# EAGLE design SSB Transceiver_LC Double Tuned Bandpass Filter (EAGLE 9.4.2)
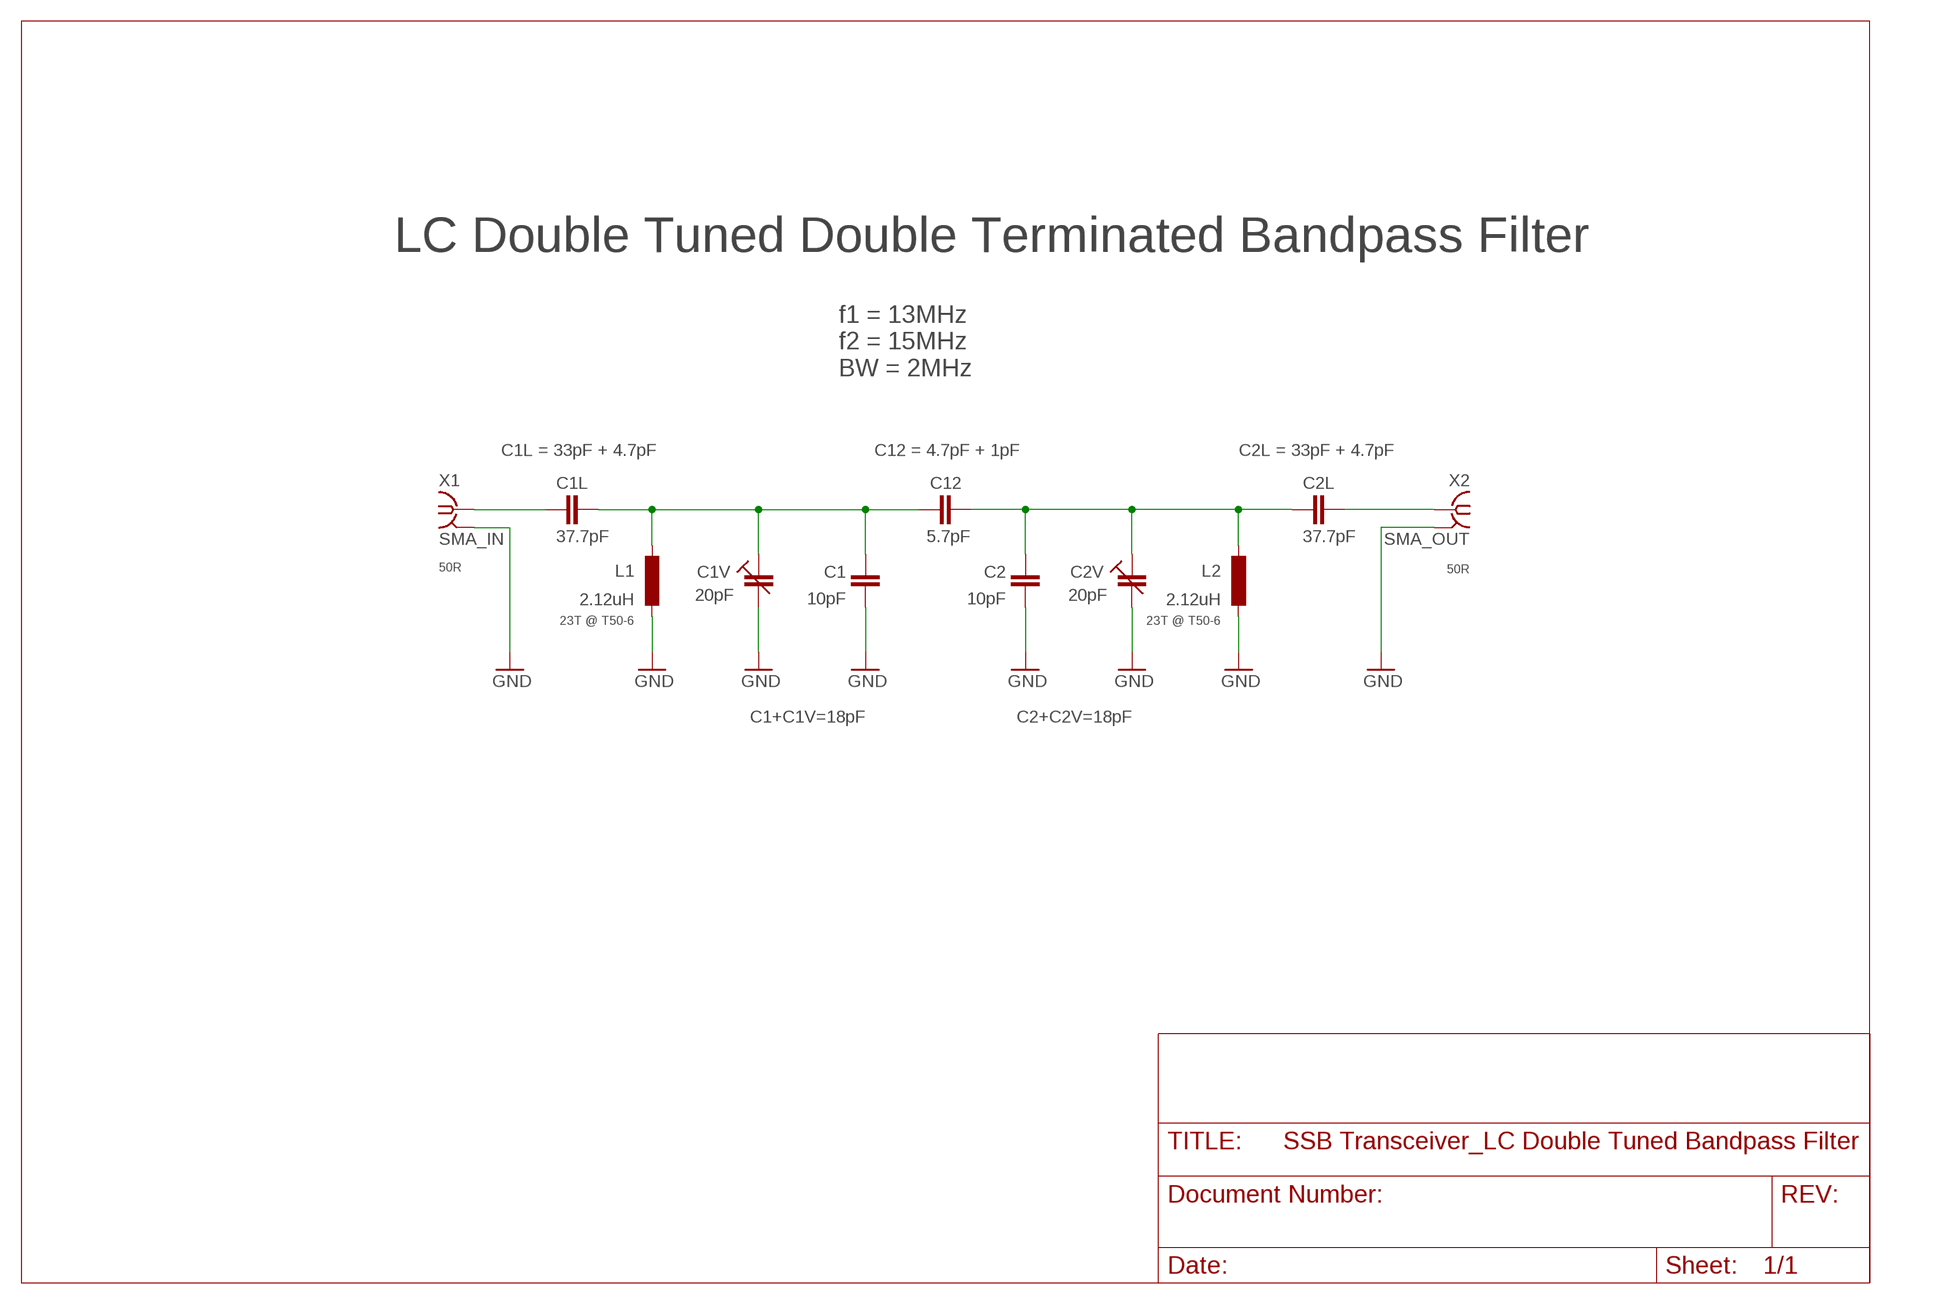
[diagram p0: schematic, sheet 1]

## Parts
C1  10pF  C-EUC0805  [C0805]
C1L  37.7pF  C-EUC0805  [C0805]
C1V  20pF  VARIABLECAP  [VARIABLECAP-SMD]
C2  10pF  C-EUC0805  [C0805]
C2L  37.7pF  C-EUC0805  [C0805]
C2V  20pF  VARIABLECAP  [VARIABLECAP-SMD]
C12  5.7pF  C-EUC0805  [C0805]
L1  2.12uH  T50-6  [T50-6SMD]
L2  2.12uH  T50-6  [T50-6SMD]
X1  SMA_IN  SMA-142-0711-821/826  [J502-ND-142-0711-821/826]
X2  SMA_OUT  SMA-142-0711-821/826  [J502-ND-142-0711-821/826]

## Nets
GND: C1.1 C1V.P$2(A) C2.1 C2V.P$2(A) L1.P$2 L2.P$2 X1.G@1 X1.G@2 X1.G@3 X1.G@4 X2.G@1 X2.G@2 X2.G@3 X2.G@4
N$1: C1.2 C1L.2 C1V.P$1(E) C12.1 L1.P$1
N$2: C2.2 C2L.2 C2V.P$1(E) C12.2 L2.P$1
N$3: C2L.1 X2.1
N$4: C1L.1 X1.1

## Notes on the sheet
- LC Double Tuned Double Terminated Bandpass Filter
- f1 = 13MHz
  f2 = 15MHz
  BW = 2MHz
- C1L = 33pF + 4.7pF | C12 = 4.7pF + 1pF | C2L = 33pF + 4.7pF
- 50R
- 50R
- 23T @ T50-6 | 23T @ T50-6
- C1+C1V=18pF | C2+C2V=18pF

## Library data of the parts
C1 C1L C2 C2L C12 = rcl:C-EU: CAPACITOR, European symbol; SPICEPREFIX: C
C1V C2V = Ham Radio:VARIABLECAP
L1 L2 = Ham Radio:T50-6
X1 X2 = con-coax:SMA-: SMA 50 Ohm End Launch Jack Receptacle - Round Contact Johnson Components Source: www.johnsoncomponents.com .. J502-ND.pdf; MF: JOHNSON COMPONENTS; MPN: 142-0711-821; OC_FARNELL: 1019328; OC_NEWARK: 16F3627

## Board
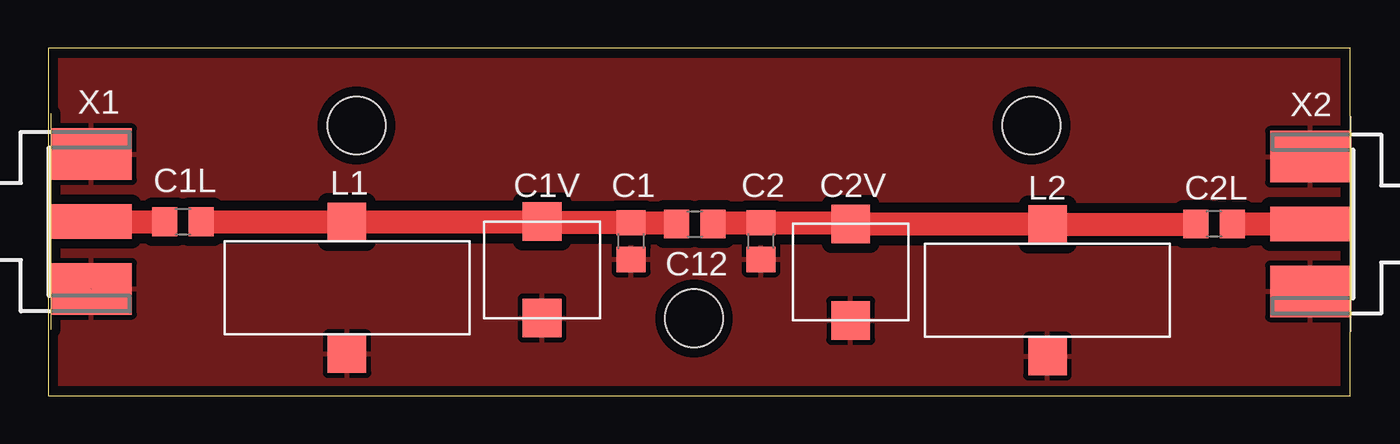
[diagram p1: board, top side]
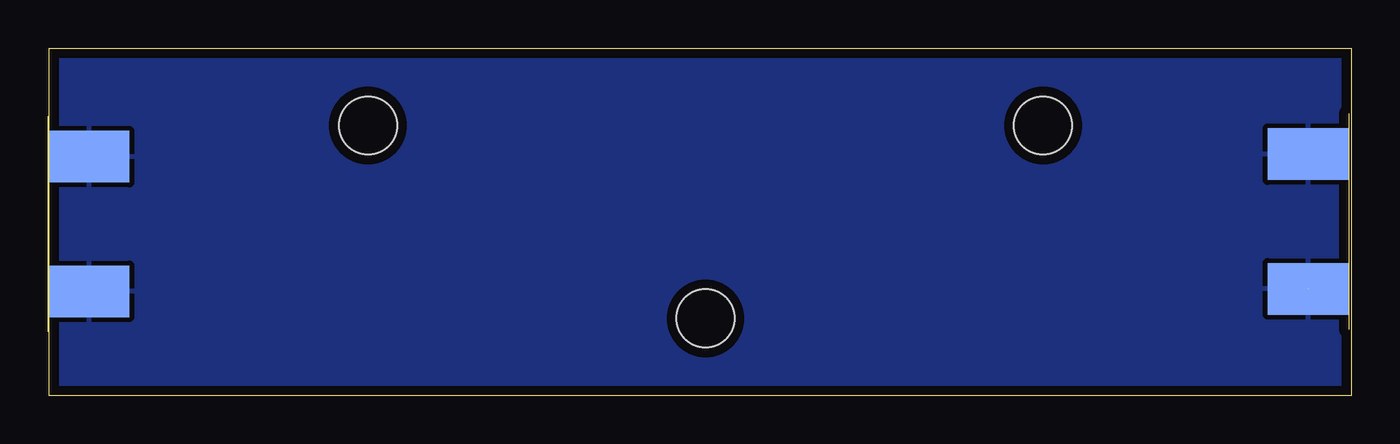
[diagram p2: board, bottom side, seen from below]

Size 67.5 x 18 mm. Coordinates in mm from the lower left corner, seen from the top.
Outline: 0,0 67.5,0 67.5,18 0,18 0,0
Copper layers (1*16): Top 0.035mm / dielectric 1.5mm / Bottom 0.035mm
Design rules "default *": minimum track width 6mil, minimum drill 0.35mm, track to track 20mil, track to pad 20mil, pad to pad 20mil, via to via 20mil, smd to smd 6mil, copper to edge 20mil, drill to drill 6mil, minimum pad ring 10mil, minimum via ring 8mil, stop-mask expansion 4mil, vias tented up to drill 0mil, thermal gap 10mil
Holes 3 mm at 33.48,4 15.98,14 50.98,14

### Footprints (pad centres in the part's own frame; a part is rotated, then mirrored left to right if it is on the bottom)
C0805 = smd 1.3 x 1.5: 1 -0.95,0; 2 0.95,0
VARIABLECAP-SMD = smd 2 x 2: P$1 0.46,2.54; P$2 0.46,-2.46
T50-6SMD = smd 2 x 2: P$1 -3.54,0; P$2 3.29,0
J502-ND-142-0711-821/826 = smd 4.191 x 1.778: 1 2.115,0 | smd 4.191 x 2.667: G@1 2.115,3.495; G@2 2.115,-3.495 | smd 4.191 x 2.667 bottom: G@3 2.115,3.495; G@4 2.115,-3.495

### Placement (x,y rotation side)
C1  30.23,8 90 top
C1L  6.99,9.02 0 top
C1V  25.15,6.48 0 top
C2  36.96,8 90 top
C2L  60.45,8.89 180 top
C2V  41.15,6.35 0 top
C12  33.53,8.89 0 top
L1  15.49,5.46 270 top
L2  51.82,5.33 270 top
X1  0.13,9.02 0 top
X2  67.56,8.89 180 top

### Tracks (layer width: path | path; a pad name or v marks a point on that pad's centre or on a via)
GND  (1 unrouted)
  pour Top (isolate 0.5): 0,0 0,18 67.5,18 67.5,0
  pour Bottom (isolate 0.5): 0,0 0,18 67.5,18 67.5,0
N$1
  Top 1.2: C12.1 32.52,8.95 C1.2 25.67,8.95 25.62,9 | 25.62,9 C1V.P$1 | C1L.2 15.48,9.02 L1.P$1 25.62,9
N$2
  Top 1.2: C12.2 34.54,8.95 C2.2 41.55,8.95 C2V.P$1 51.8,8.89 L2.P$1 59.49,8.87 C2L.2
N$3
  Top 1.2: C2L.1 X2.1
N$4
  Top 1.2: X1.1 C1L.1